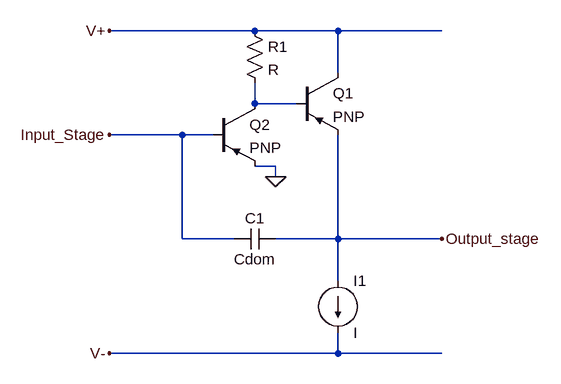
[diagram p0: schematic Draft5.asc]
Draft5.asc, the LTspice schematic file:
Version 4
SHEET 1 880 680
WIRE 128 -48 -96 -48
WIRE 256 -48 128 -48
WIRE 416 -48 256 -48
WIRE 256 16 256 -48
WIRE 128 64 128 32
WIRE 192 64 128 64
WIRE 16 112 -96 112
WIRE 64 112 16 112
WIRE 160 160 128 160
WIRE 160 176 160 160
WIRE 16 272 16 112
WIRE 96 272 16 272
WIRE 256 272 256 112
WIRE 256 272 160 272
WIRE 416 272 256 272
WIRE 256 336 256 272
WIRE 256 448 256 416
WIRE 256 448 -96 448
WIRE 416 448 256 448
FLAG 160 176 0
FLAG -96 112 Input_Stage
FLAG -96 -48 V+
FLAG 416 272 Output_stage
FLAG -96 448 V-
SYMBOL pnp 192 16 R0
SYMATTR InstName Q1
SYMBOL pnp 64 64 R0
SYMATTR InstName Q2
SYMBOL res 112 -64 R0
SYMATTR InstName R1
SYMBOL cap 160 256 R90
WINDOW 0 0 32 VBottom 2
WINDOW 3 32 32 VTop 2
SYMATTR InstName C1
SYMATTR Value Cdom
SYMBOL current 256 336 R0
SYMATTR InstName I1

The netlist it stands for:
* Draft5.asc
Q1 V+ N001 Output_stage 0 PNP
Q2 N001 Input_Stage 0 0 PNP
R1 V+ N001 R
C1 Output_stage Input_Stage Cdom
I1 Output_stage V- I
.model NPN NPN
.model PNP PNP
.lib standard.bjt
.backanno
.end